# EAGLE schematic EEPROM AT28C16 Helper (EAGLE 7.6.0)
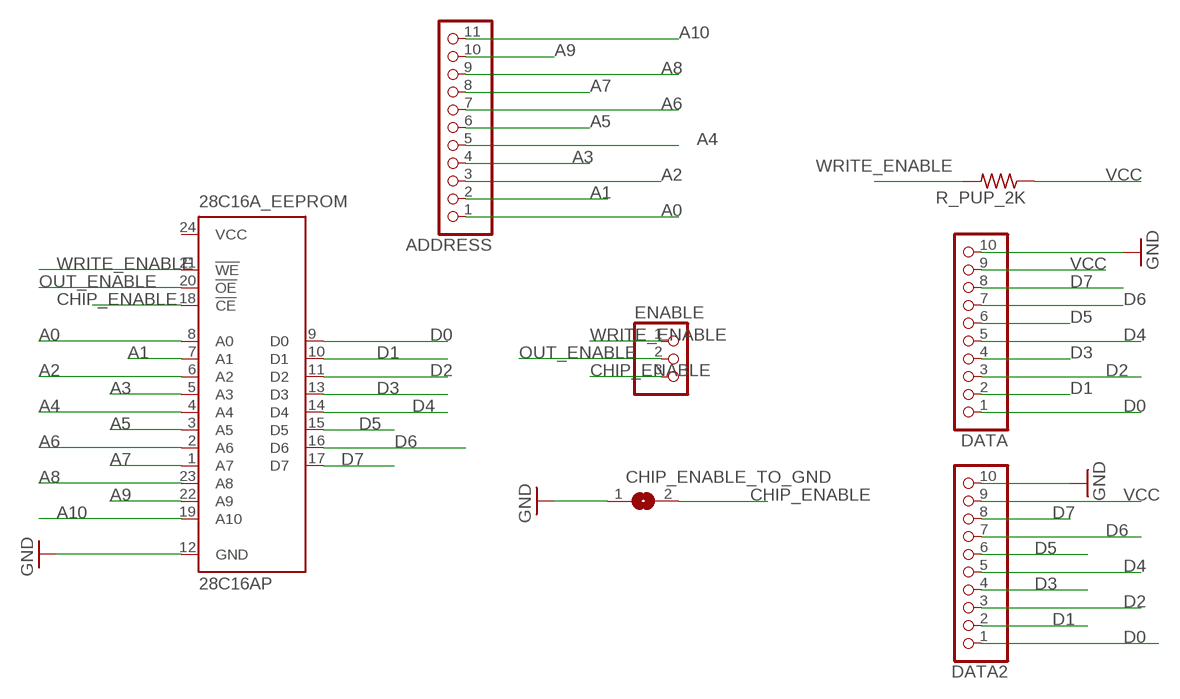
[diagram p0: schematic, sheet 1]

## Parts
28C16A_EEPROM  28C16AP  [DIL24-6]
ADDRESS  PINHD-1X11  [1X11]
CHIP_ENABLE_TO_GND  SOLDERJUMPERREFLOW  [SOLDERJUMPER_REFLOW]
DATA  PINHD-1X10  [1X10-BIG]
DATA2  PINHD-1X10  [1X10-BIG]
ENABLE  PINHD-1X3  [1X03]
R_PUP_2K  R-US_R1206  [R1206]

## Nets
A0: 28C16A_EEPROM.8(A0) ADDRESS.1
A1: 28C16A_EEPROM.7(A1) ADDRESS.2
A2: 28C16A_EEPROM.6(A2) ADDRESS.3
A3: 28C16A_EEPROM.5(A3) ADDRESS.4
A4: 28C16A_EEPROM.4(A4) ADDRESS.5
A5: 28C16A_EEPROM.3(A5) ADDRESS.6
A6: 28C16A_EEPROM.2(A6) ADDRESS.7
A7: 28C16A_EEPROM.1(A7) ADDRESS.8
A8: 28C16A_EEPROM.23(A8) ADDRESS.9
A9: 28C16A_EEPROM.22(A9) ADDRESS.10
A10: 28C16A_EEPROM.19(A10) ADDRESS.11
CHIP_ENABLE: 28C16A_EEPROM.18(!CE) CHIP_ENABLE_TO_GND.2 ENABLE.3
D0: 28C16A_EEPROM.9(D0) DATA2.1 DATA.1
D1: 28C16A_EEPROM.10(D1) DATA2.2 DATA.2
D2: 28C16A_EEPROM.11(D2) DATA2.3 DATA.3
D3: 28C16A_EEPROM.13(D3) DATA2.4 DATA.4
D4: 28C16A_EEPROM.14(D4) DATA2.5 DATA.5
D5: 28C16A_EEPROM.15(D5) DATA2.6 DATA.6
D6: 28C16A_EEPROM.16(D6) DATA2.7 DATA.7
D7: 28C16A_EEPROM.17(D7) DATA2.8 DATA.8
GND: 28C16A_EEPROM.12(GND) CHIP_ENABLE_TO_GND.1 DATA2.10 DATA.10
OUT_ENABLE: 28C16A_EEPROM.20(!OE) ENABLE.2
VCC: DATA2.9 DATA.9 R_PUP_2K.1
WRITE_ENABLE: 28C16A_EEPROM.21(!WE) ENABLE.1 R_PUP_2K.2

## Power pins joined to a net without a drawn wire
VCC: 28C16A_EEPROM.24(VCC)

## Library data of the parts
28C16A_EEPROM = microchip:28*16A: CMOS EPROM 16 K (2 K x 8) Source: ww1.microchip.com/downloads/en/DeviceDoc/11125J.pdf; MPN: CAT28C16ALI-12; OC_FARNELL: 1718292; OC_NEWARK: 06R0648
ADDRESS = pinhead:PINHD-1X11: PIN HEADER
CHIP_ENABLE_TO_GND = microbuilder:SOLDERJUMPER: SMD Solder JUMPER Solder the two pads together to create a connection, or remove the solder to break it. REFLOW - Use this footprint for solder paste and reflow ovens. WAVE - Use this footprint for hand-soldering (larger pads). CLOSED - Has a trace between the two pads to ensure it is closed by default. The trace needs to be cut to disable the jumper, and can be closed again by creating a solder bridge between the two pads.
DATA DATA2 = adafruit:PINHD-1X10: Pin header 1x10 0.1" spacing With round pins
ENABLE = adafruit:PINHD-1X3: PIN HEADER
R_PUP_2K = adafruit:R-US_: RESISTOR, American symbol